# Altium schematic sheet STM32.SchDoc
size B; SheetNumber: 1; SheetTotal: 1
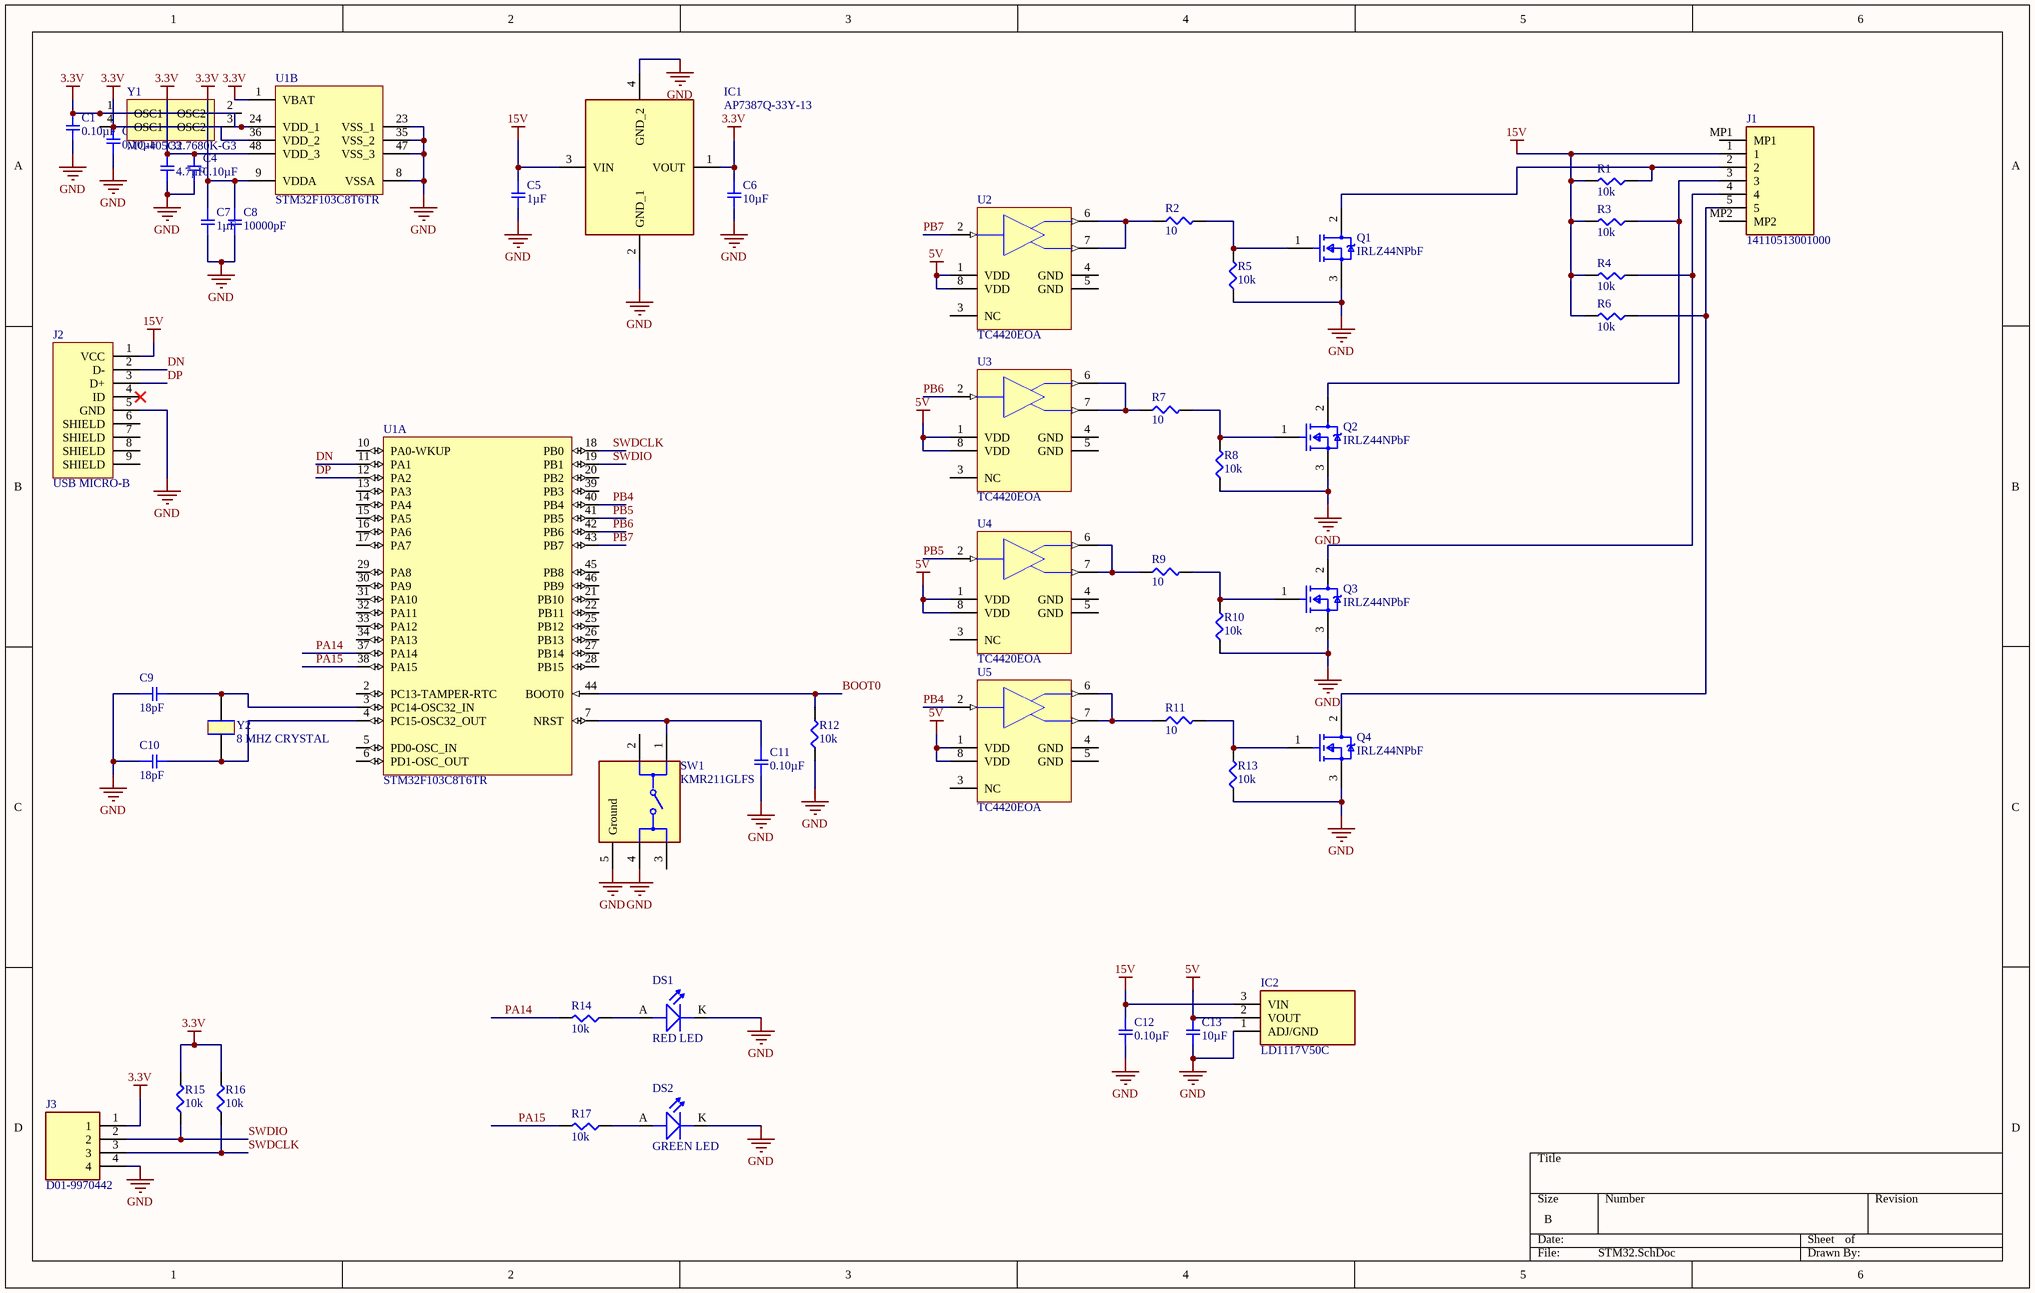
[diagram p0: STM32.SchDoc]

## Parts
C1  0.10µF  [SMD-0402C]
C2  0.10µF  [SMD-0402C]
C3  4.7µF  [SMD-0402C]
C4  0.10µF  [SMD-0402C]
C5  1µF  [SMD-0402C]
C6  10µF  [SMD-0402C]
C7  1µF  [SMD-0402C]
C8  10000pF  [SMD-0402C]
C9  18pF  [SMD-0402C]
C10  18pF  [SMD-0402C]
C11  0.10µF  [SMD-0402C]
C12  0.10µF  [SMD-0402C]
C13  10µF  [SMD-0402C]
DS1  RED LED  [LED_0805]
DS2  GREEN LED  [LED_0805]
IC1  AP7387Q-33Y-13  [AP7387Q50Y13]
IC2  LD1117V50C  [TO255P460X1020X2008-3P]
J1  14110513001000  [14110513001000]
J2  USB MICRO-B  [CON_10118192-0001LF_SMD]
J3  D01-9970442  [RHDR4W53P0X254_1X4_1016X246X254P]
Q1  IRLZ44NPbF  [FP-PG-TO220-3-MFG]
Q2  IRLZ44NPbF  [FP-PG-TO220-3-MFG]
Q3  IRLZ44NPbF  [FP-PG-TO220-3-MFG]
Q4  IRLZ44NPbF  [FP-PG-TO220-3-MFG]
R1  10k  [SMD-0402-RES]
R2  10  [SMD-0402-RES]
R3  10k  [SMD-0402-RES]
R4  10k  [SMD-0402-RES]
R5  10k  [SMD-0402-RES]
R6  10k  [SMD-0402-RES]
R7  10  [SMD-0402-RES]
R8  10k  [SMD-0402-RES]
R9  10  [SMD-0402-RES]
R10  10k  [SMD-0402-RES]
R11  10  [SMD-0402-RES]
R12  10k  [SMD-0402-RES]
R13  10k  [SMD-0402-RES]
R14  10k  [SMD-0402-RES]
R15  10k  [SMD-0402-RES]
R16  10k  [SMD-0402-RES]
R17  10k  [SMD-0402-RES]
SW1  KMR211GLFS  [FP-KMR211GLFS-MFG]
U1  STM32F103C8T6TR  [STM-LQFP48_L]  (parts A,B of 2)
U2  TC4420EOA  [SOIC-OA8_M]
U3  TC4420EOA  [SOIC-OA8_M]
U4  TC4420EOA  [SOIC-OA8_M]
U5  TC4420EOA  [SOIC-OA8_M]
Y1  MC-405 32.7680K-G3  [XTAL_125_74X51_SMD]
Y2  8 MHZ CRYSTAL  [XTAL_193_184X455_TH]

## Nets
3.3V: C1.1 C2.1 C3.1 C4.1 C6.1 C7.1 C8.1 IC1.1(VOUT) J3.1 R15.2 R16.2 U1.1(VBAT) U1.9(VDDA) U1.24(VDD_1) U1.36(VDD_2) U1.48(VDD_3) Y1.1(OSC1) Y1.3(OSC2)
5V: C13.1 IC2.2(VOUT) U2.1(VDD) U2.8(VDD) U3.1(VDD) U3.8(VDD) U4.1(VDD) U4.8(VDD) U5.1(VDD) U5.8(VDD)
15V: C5.1 C12.1 IC1.3(VIN) IC2.3(VIN) J1.1 J2.1(VCC) R1.2 R3.2 R4.2 R6.2
GND: C1.2 C2.2 C3.2 C4.2 C5.2 C6.2 C7.2 C8.2 C9.1 C10.1 C11.2 C12.2 C13.2 DS1.K(CATHODE) DS2.K(CATHODE) IC1.2(GND_1) IC1.4(GND_2) IC2.1(ADJ/GND) J2.5(GND) J3.4 Q1.3(S) Q2.3(S) Q3.3(S) Q4.3(S) R5.1 R8.1 R10.1 R12.1 R13.1 SW1.4 SW1.5(Ground) U1.8(VSSA) U1.23(VSS_1) U1.35(VSS_2) U1.47(VSS_3)
BOOT0: R12.2 U1.44(BOOT0)
DN: J2.2(D-) U1.11(PA1)
DP: J2.3(D+) U1.12(PA2)
PA14: R14.2 U1.37(PA14)
PA15: R17.2 U1.38(PA15)
PB4: U1.40(PB4) U5.2(IN)
PB5: U1.41(PB5) U4.2(IN)
PB6: U1.42(PB6) U3.2(IN)
PB7: U1.43(PB7) U2.2(IN)
SWDCLK: J3.3 R16.1 U1.18(PB0)
SWDIO: J3.2 R15.1 U1.19(PB1)
NetC9_2: C9.2 U1.3(PC14-OSC32_IN) Y2.2
NetC10_2: C10.2 U1.4(PC15-OSC32_OUT) Y2.1
NetC11_1: C11.1 SW1.1 U1.7(NRST)
NetDS1_A: DS1.A(ANODE) R14.1
NetDS2_A: DS2.A(ANODE) R17.1
NetJ1_2: J1.2 Q1.2(D) R1.1
NetJ1_3: J1.3 Q2.2(D) R3.1
NetJ1_4: J1.4 Q3.2(D) R4.1
NetJ1_5: J1.5 Q4.2(D) R6.1
NetQ1_1: Q1.1(G) R2.2 R5.2
NetQ2_1: Q2.1(G) R7.2 R8.2
NetQ3_1: Q3.1(G) R9.2 R10.2
NetQ4_1: Q4.1(G) R11.2 R13.2
NetR2_1: R2.1 U2.6(OUT) U2.7(OUT)
NetR7_1: R7.1 U3.6(OUT) U3.7(OUT)
NetR9_1: R9.1 U4.6(OUT) U4.7(OUT)
NetR11_1: R11.1 U5.6(OUT) U5.7(OUT)

Not connected (* = marked no-connect by the designer): J1 MP1 MP2; J2 4(ID)* 6(SHIELD) 7(SHIELD) 8(SHIELD) 9(SHIELD); SW1 2 3; U1 2(PC13-TAMPER-RTC) 5(PD0-OSC_IN) 6(PD1-OSC_OUT) 10(PA0-WKUP) 13(PA3) 14(PA4) 15(PA5) 16(PA6) 17(PA7) 20(PB2) 21(PB10) 22(PB11) 25(PB12) 26(PB13) 27(PB14) 28(PB15) 29(PA8) 30(PA9) 31(PA10) 32(PA11) 33(PA12) 34(PA13) 39(PB3) 45(PB8) 46(PB9); U2 3(NC) 4(GND) 5(GND); U3 3(NC) 4(GND) 5(GND); U4 3(NC) 4(GND) 5(GND); U5 3(NC) 4(GND) 5(GND); Y1 2(OSC2) 4(OSC1)

## Library data of the parts
C1 C2 C4 = GRM152C80J104KE19D: CAP CER 0.1UF 6.3V X6S 0402; Manufacturer: Murata Electronics North America; Factory Stock: 0; Unit Price (USD): 0.15; Minimum Quantity: 1; Tolerance: ±10%; Datasheets: http://www.murata.com/~/media/webrenewal/support/library/catalog/products/capacitor/mlcc/c02e.pdf; Image: //media.digikey.com/Renders/Murata%20Renders/ZRB-SERIES-0402.jpg; Digi-Key Part Number: 490-9997-1-ND; Part Number: GRM152C80J104KE19D; Quantity Available: 10685; @ qty: 0; Packaging: Cut Tape (CT); Series: GRM; Part Status: Active; Value: 0.10µF; Voltage: 6.3V; Temperature Coefficient: X6S; Operating Temperature: -55°C ~ 105°C; Features: Derating Recommended; Ratings: -; Applications: General Purpose; Mounting Type: Surface Mount, MLCC; Package / Case: 0402 (1005 Metric); Size / Dimension: 0.039" L x 0.020" W (1.00mm x 0.50mm); Height - Seated (Max): -; Thickness (Max): 0.009" (0.22mm); Lead Spacing: -; Lead Style: -
C3 = GRM153R60J475ME15D: CAP CER 4.7UF 6.3V X5R 0402; Manufacturer: Murata Electronics North America; Factory Stock: 0; Unit Price (USD): 0.27; Minimum Quantity: 1; Tolerance: ±20%; Datasheets: http://psearch.en.murata.com/capacitor/product/GRM153R60J475ME15%23.pdf; Image: //media.digikey.com/Renders/Murata%20Renders/ZRB-SERIES-0402.jpg; Digi-Key Part Number: 490-13232-1-ND; Part Number: GRM153R60J475ME15D; Quantity Available: 30412; @ qty: 0; Packaging: Cut Tape (CT); Series: GRM; Part Status: Active; Value: 4.7µF; Voltage: 6.3V; Temperature Coefficient: X5R; Operating Temperature: -55°C ~ 85°C; Features: Derating Recommended; Ratings: -; Applications: General Purpose; Mounting Type: Surface Mount, MLCC; Package / Case: 0402 (1005 Metric); Size / Dimension: 0.039" L x 0.020" W (1.00mm x 0.50mm); Height - Seated (Max): -; Thickness (Max): 0.013" (0.33mm); Lead Spacing: -; Lead Style: -
C5 = GRT155R61E105KE01D: CAP CER 1UF 25V X5R 0402; Manufacturer: Murata Electronics North America; Factory Stock: 0; Unit Price (USD): 0.12; Minimum Quantity: 1; Tolerance: ±10%; Datasheets: http://search.murata.co.jp/Ceramy/image/img/A01X/G101/ENG/GRT155R61E105KE01-01.pdf; Image: //media.digikey.com/Renders/Murata%20Renders/ZRB-SERIES-0402.jpg; Digi-Key Part Number: 490-12263-1-ND; Part Number: GRT155R61E105KE01D; Quantity Available: 12190; @ qty: 0; Packaging: Cut Tape (CT); Series: GRT; Part Status: Active; Value: 1µF; Voltage: 25V; Temperature Coefficient: X5R; Operating Temperature: -55°C ~ 85°C; Features: Derating Recommended; Ratings: AEC-Q200; Applications: Automotive; Mounting Type: Surface Mount, MLCC; Package / Case: 0402 (1005 Metric); Size / Dimension: 0.039" L x 0.020" W (1.00mm x 0.50mm); Height - Seated (Max): -; Thickness (Max): 0.022" (0.55mm); Lead Spacing: -; Lead Style: -
C6 C13 = GRM155C80J106ME11D: CAP CER 10UF 6.3V X6S 0402; Manufacturer: Murata Electronics North America; Factory Stock: 0; Unit Price (USD): 0.18; Minimum Quantity: 1; Tolerance: ±20%; Datasheets: http://psearch.en.murata.com/capacitor/product/GRM155C80J106ME11%23.pdf; Image: //media.digikey.com/Renders/Murata%20Renders/ZRB-SERIES-0402.jpg; Digi-Key Part Number: 490-13233-1-ND; Part Number: GRM155C80J106ME11D; Quantity Available: 60962; @ qty: 0; Packaging: Cut Tape (CT); Series: GRM; Part Status: Active; Value: 10µF; Voltage: 6.3V; Temperature Coefficient: X6S; Operating Temperature: -55°C ~ 105°C; Features: Derating Recommended; Ratings: -; Applications: General Purpose; Mounting Type: Surface Mount, MLCC; Package / Case: 0402 (1005 Metric); Size / Dimension: 0.039" L x 0.020" W (1.00mm x 0.50mm); Height - Seated (Max): -; Thickness (Max): 0.028" (0.70mm); Lead Spacing: -; Lead Style: -
C7 = GCM155C71A105KE38D: CAP CER 1UF 10V X7S 0402; Manufacturer: Murata Electronics North America; Factory Stock: 0; Unit Price (USD): 0.12; Minimum Quantity: 1; Tolerance: ±10%; Datasheets: http://www.murata.com/~/media/webrenewal/support/library/catalog/products/capacitor/mlcc/c03e.ashx; Image: //media.digikey.com/Renders/Murata%20Renders/ZRB-SERIES-0402.jpg; Digi-Key Part Number: 490-13409-1-ND; Part Number: GCM155C71A105KE38D; Quantity Available: 7240; @ qty: 0; Packaging: Cut Tape (CT); Series: GCM; Part Status: Active; Value: 1µF; Voltage: 10V; Temperature Coefficient: X7S; Operating Temperature: -55°C ~ 125°C; Features: -; Ratings: AEC-Q200; Applications: Automotive; Mounting Type: Surface Mount, MLCC; Package / Case: 0402 (1005 Metric); Size / Dimension: 0.039" L x 0.020" W (1.00mm x 0.50mm); Height - Seated (Max): -; Thickness (Max): 0.022" (0.55mm); Lead Spacing: -; Lead Style: -
C8 = GCM155R71E103KA37D: CAP CER 10000PF 25V X7R 0402; Manufacturer: Murata Electronics North America; Factory Stock: 0; Unit Price (USD): 0.1; Minimum Quantity: 1; Tolerance: ±10%; Datasheets: http://www.murata.com/~/media/webrenewal/support/library/catalog/products/capacitor/mlcc/c03e.ashx; Image: //media.digikey.com/Renders/Murata%20Renders/ZRB-SERIES-0402.jpg; Digi-Key Part Number: 490-6043-1-ND; Part Number: GCM155R71E103KA37D; Quantity Available: 128782; @ qty: 0; Packaging: Cut Tape (CT); Series: GCM; Part Status: Active; Value: 10000pF; Voltage: 25V; Temperature Coefficient: X7R; Operating Temperature: -55°C ~ 125°C; Features: -; Ratings: AEC-Q200; Applications: Automotive; Mounting Type: Surface Mount, MLCC; Package / Case: 0402 (1005 Metric); Size / Dimension: 0.039" L x 0.020" W (1.00mm x 0.50mm); Height - Seated (Max): -; Thickness (Max): 0.022" (0.55mm); Lead Spacing: -; Lead Style: -
C9 C10 = GRM1555C1E180JA01D: CAP CER 18PF 25V NP0 0402; Manufacturer: Murata Electronics North America; Factory Stock: 0; Unit Price (USD): 0.1; Minimum Quantity: 1; Tolerance: ±5%; Temperature Coefficient: C0G, NP0; Datasheets: http://www.murata.com/~/media/webrenewal/support/library/catalog/products/capacitor/mlcc/c02e.pdf; Image: //media.digikey.com/Renders/Murata%20Renders/ZRB-SERIES-0402.jpg; Digi-Key Part Number: 490-6172-1-ND; Part Number: GRM1555C1E180JA01D; Quantity Available: 78161; @ qty: 0; Packaging: Cut Tape (CT); Series: GRM; Part Status: Active; Value: 18pF; Voltage: 25V; Operating Temperature: -55°C ~ 125°C; Features: -; Ratings: -; Applications: General Purpose; Mounting Type: Surface Mount, MLCC; Package / Case: 0402 (1005 Metric); Size / Dimension: 0.039" L x 0.020" W (1.00mm x 0.50mm); Height - Seated (Max): -; Thickness (Max): 0.022" (0.55mm); Lead Spacing: -; Lead Style: -
C11 = GRM152C80J104ME19D: CAP CER 0.1UF 6.3V X6S 0402; Manufacturer: Murata Electronics North America; Factory Stock: 0; Unit Price (USD): 0.15; Minimum Quantity: 1; Tolerance: ±20%; Datasheets: http://www.murata.com/~/media/webrenewal/support/library/catalog/products/capacitor/mlcc/c02e.pdf; Image: //media.digikey.com/Renders/Murata%20Renders/ZRB-SERIES-0402.jpg; Digi-Key Part Number: 490-9998-1-ND; Part Number: GRM152C80J104ME19D; Quantity Available: 19095; @ qty: 0; Packaging: Cut Tape (CT); Series: GRM; Part Status: Active; Value: 0.10µF; Voltage: 6.3V; Temperature Coefficient: X6S; Operating Temperature: -55°C ~ 105°C; Features: Derating Recommended; Ratings: -; Applications: General Purpose; Mounting Type: Surface Mount, MLCC; Package / Case: 0402 (1005 Metric); Size / Dimension: 0.039" L x 0.020" W (1.00mm x 0.50mm); Height - Seated (Max): -; Thickness (Max): 0.009" (0.22mm); Lead Spacing: -; Lead Style: -
C12 = GCM155R71C104KA55D: CAP CER 0.1UF 16V X7R 0402; Manufacturer: Murata Electronics North America; Factory Stock: 0; Unit Price (USD): 0.1; Minimum Quantity: 1; Tolerance: ±10%; Datasheets: http://www.murata.com/~/media/webrenewal/support/library/catalog/products/capacitor/mlcc/c03e.ashx; Image: //media.digikey.com/Renders/Murata%20Renders/ZRB-SERIES-0402.jpg; Digi-Key Part Number: 490-4759-1-ND; Part Number: GCM155R71C104KA55D; Quantity Available: 734194; @ qty: 0; Packaging: Cut Tape (CT); Series: GCM; Part Status: Active; Value: 0.10µF; Voltage: 16V; Temperature Coefficient: X7R; Operating Temperature: -55°C ~ 125°C; Features: -; Ratings: AEC-Q200; Applications: Automotive; Mounting Type: Surface Mount, MLCC; Package / Case: 0402 (1005 Metric); Size / Dimension: 0.039" L x 0.020" W (1.00mm x 0.50mm); Height - Seated (Max): -; Thickness (Max): 0.022" (0.55mm); Lead Spacing: -; Lead Style: -
DS1 = LED_RED-2V-20mA-0805: Red 631nm LED Indication - Discrete 2V 0805 (2012 Metric); Manufacturer: Vishay Lite-On; Manufacturer Part Number: LTST-C171KRKT; Alternate Part Number-1: NA; Case/Package: 0805; Supplier-1: SP ROAD; Supplier Part Number-1: LTST-C171KRKT
DS2 = LED_GREEN-2.2-20mA-0805: Green 569nm LED Indication - Discrete 2.1V 0805 (2012 Metric); Manufacturer: Vishay Lite-On; Manufacturer Part Number: LTST-C171GKT; Alternate Part Number-1: NA; Case/Package: 0805; Supplier-1: SP ROAD; Supplier Part Number-1: LTST-C171GKT
IC1 = AP7387Q-33Y-13: Integrated Circuit; Manufacturer_Name: Diodes Inc.; Datasheet Link: https://www.diodes.com/assets/Datasheets/AP7387Q.pdf; Height: 1.6mm; Manufacturer_Part_Number: AP7387Q-33Y-13; Mouser Part Number: 621-AP7387Q-33Y-13; Mouser Price/Stock: https://www.mouser.co.uk/ProductDetail/Diodes-Incorporated/AP7387Q-33Y-13?qs=Y0Uzf4wQF3kvZEnH8zEZig%3D%3D
IC2 = LD1117V50C: Integrated Circuit; Manufacturer_Name: STMicroelectronics; Datasheet Link: https://www.st.com/resource/en/datasheet/ld1117.pdf; Height: 4.6mm; Manufacturer_Part_Number: LD1117V50C; Mouser Part Number: 511-LD1117V50C; Mouser Price/Stock: https://www.mouser.co.uk/ProductDetail/STMicroelectronics/LD1117V50C?qs=1tTY8DFIKADwAqdjtz3zSA%3D%3D; Arrow Part Number: LD1117V50C; Arrow Price/Stock: https://www.arrow.com/en/products/ld1117v50c/stmicroelectronics
J1 = 14110513001000: Connector; Manufacturer_Name: HARTING; Datasheet Link: https://b2b.harting.com/files/download/PRD/PDF_DS/PDF_DS_14111400301.pdf; Height: 7.45mm; Manufacturer_Part_Number: 14110513001000; Mouser Part Number: 617-14110513001000; Mouser Price/Stock: https://www.mouser.co.uk/ProductDetail/HARTING/14110513001000?qs=9nYkJLYMUzvq4GdFieWOAA%3D%3D; Arrow Part Number: 14110513001000; Arrow Price/Stock: https://www.arrow.com/en/products/14110513001000/harting
J2 = CON_USB2.0_MICROB-SMD: USB - micro B USB 2.0 Receptacle Connector 5 Position Surface Mount, Right Angle; Manufacturer: ICC; Manufacturer Part Number: 10118192-0001LF; Alternate Part Number-1: NA; Case/Package: USB MICRO-B SMD; Supplier-1: SUNROM; Supplier Part Number-1: MICRO USB
J3 = D01-9970442: Connector; Manufacturer_Name: Harwin; Datasheet Link: https://cdn.harwin.com/pdfs/D01-997.pdf; Height: 2.54mm; Manufacturer_Part_Number: D01-9970442; Mouser Part Number: 855-D01-9970442; Mouser Price/Stock: https://www.mouser.co.uk/ProductDetail/Harwin/D01-9970442?qs=ecHgFjcWJS%252BUW8IMx%252Bcpow%3D%3D
Q1-Q4 = CMP-32901-000488-1: MOSFET N-CH 55V 47A TO220AB; Turn-On Delay Time: 11ns; Gate to Source Voltage (Vgs): 16V; Element Configuration: Single; Rds On Max: 22mR; Turn-Off Delay Time: 26ns; Max Power Dissipation: 110W; Threshold Voltage: 2V; Drain to Source Resistance: 35mR; Input Capacitance: 1.7nF; Continuous Drain Current (ID): 47A; Case/Package: TO-220; Lead Free: Lead Free; Halogen Free: Halogen Free; Packaging: Rail/Tube; Length: 0.414inch; Min Operating Temperature: -55°C; REACH SVHC: No SVHC; Number of Pins: 3; Width: 0.185inch; Drain to Source Voltage (Vdss): 55V; Power Dissipation: 110W; RoHS Compliant: Yes; Max Operating Temperature: 175°C; Height: 0.6inch; Max Dual Supply Voltage: 55V; Drain to Source Breakdown Voltage: 55V; Mount: Through Hole
R1 R3-R6 R8 R10 R12-R17 = ERJ-2GEJ103X: RES SMD 10K OHM 5% 1/10W 0402; Manufacturer: Panasonic Electronic Components; Factory Stock: 0; Unit Price (USD): 0.00350; @ qty: 1500; Minimum Quantity: 1; Power (Watts): 0.1W, 1/10W; Temperature Coefficient: ±200ppm/°C; Part Number: ERJ-2GEJ103X; Datasheets: http://industrial.panasonic.com/www-cgi/jvcr13pz.cgi?E+PZ+3+AOA0001+ERJ2GEJ103X+7+WW; Image: //media.digikey.com/Photos/Panasonic%20Photos/ERJ-PA2-Series.jpg; Digi-Key Part Number: P10KJCT-ND; Quantity Available: 2560215; Packaging: Cut Tape (CT); Series: ERJ; Part Status: Active; Value: 10k; Tolerance: ±5%; Composition: Thick Film; Features: Automotive AEC-Q200; Operating Temperature: -55°C ~ 155°C; Package / Case: 0402 (1005 Metric); Supplier Device Package: 0402; Size / Dimension: 0.039" L x 0.020" W (1.00mm x 0.50mm); Height - Seated (Max): 0.016" (0.40mm); Number of Terminations: 2; Failure Rate: -
R2 R7 R9 R11 = ERJ-2RKF10R0X: RES SMD 10 OHM 1% 1/10W 0402; Manufacturer: Panasonic Electronic Components; Factory Stock: 0; Unit Price (USD): 0.00496; @ qty: 1500; Minimum Quantity: 1; Power (Watts): 0.1W, 1/10W; Temperature Coefficient: ±100ppm/°C; Part Number: ERJ-2RKF10R0X; Datasheets: http://industrial.panasonic.com/www-cgi/jvcr13pz.cgi?E+PZ+3+AOA0002+ERJ2RKF10R0X+7+WW; Image: //media.digikey.com/Photos/Panasonic%20Photos/ERJ-PA2-Series.jpg; Digi-Key Part Number: P10.0LCT-ND; Quantity Available: 1668494; Packaging: Cut Tape (CT); Series: ERJ; Part Status: Active; Value: 10; Tolerance: ±1%; Composition: Thick Film; Features: Automotive AEC-Q200; Operating Temperature: -55°C ~ 155°C; Package / Case: 0402 (1005 Metric); Supplier Device Package: 0402; Size / Dimension: 0.039" L x 0.020" W (1.00mm x 0.50mm); Height - Seated (Max): 0.016" (0.40mm); Number of Terminations: 2; Failure Rate: -
SW1 = CMP-10040-000023-1: SWITCH TACTILE SPST-NO 0.05A 32V; Switch Function: Off-Mom; Throw Configuration: SPST; Switch Travel: 0.2mm; Current Rating: 50mA; Illumination Type: Non-Illuminated; Actuator Length: 0.5mm; Power Rating: 1W; Operating Force: 1.2N; Actuator Type: Standard; Mechanical Life: 200000Cycles; REACH SVHC: No SVHC; Voltage Rating (DC): 32V; Length: 2.8mm; Min Operating Temperature: -40°C; Mount: Surface Mount; Max Voltage Rating (DC): 32V; Width: 2.8mm; Depth: 4.6mm; Packaging: Tape and Reel; Lead Free: Lead Free; Contact Material: Silver; Termination: Gull Wing; Package Quantity: 1; Contact Current Rating: 50mA; Orientation: Straight; Max Operating Temperature: 85°C; Radiation Hardening: No; Max Current Rating: 50mA; Contact Plating: Silver
U1 = CMP-0237-00216-3: ARM Cortex-M3 32-bit MCU, 64 KB Flash, 20 KB Internal RAM, 37 I/Os, 48-pin LQFP, -40 to 85 degC, Tape and Reel; A/D Converter: 2x12-bit (10 Channel); Internal RAM Size (kB): 20; Supply Voltage(Vcc) min (V): 2; I/Os (High Current): 37; FLASH Size (Prog) (kB): 64; Operating Frequency(F) (Processor speed) (MHz): 72; Packing: Tape and Reel; PackageReference: LQFP48; ComponentLink2Description: Datasheet; Core: ARM Cortex-M3; ComponentLink3URL: http://www.st.com/st-web-ui/static/active/en/resource/technical/document/datasheet/DM00058181.pdf; ComponentLink1Description: Manufacturer URL; ComponentLink3Description: Package Specification; PartNumber: STM32F103C8T6TR; PackageVersion: Rev. 6, 06/2013; ComponentLink2URL: http://www.st.com/st-web-ui/static/active/en/resource/technical/document/datasheet/CD00161566.pdf; PackageDescription: 48-Pin Low Profile Quad Flat Package, 7 x 7 mm Body, 0.5 mm Pitch; Mounting Technology: Surface Mount; DatasheetVersion: Rev. 16; ComponentLink1URL: http://www.st.com/web/en/home.html
U2-U5 = CMP-0137-00254-1: 6A High-Speed MOSFET Driver, Non-Inverting, Industrial Temperature; PackageReference: SOIC-OA8; DatasheetVersion: revC, Aug-2004; Code_IPC: SOIC127P600-8; PackageVersion: revBB, Aug-2009; PackageDescription: 8-Lead Plastic Small Outline (OA) - Narrow, 3.90mm Body [SOIC]
Y1 = XTAL_32.768K-MC-405 32.7680K-G3: 32.768kHz ±100ppm Crystal 20pF 50 kOhms 4-SOJ, 5.50mm pitch; Manufacturer: EPSON; Alternate Part Number-1: MC-405 32.7680K-AC0: ROHS; Manufacturer Part Number: MC-405 32.7680K-G3; Case/Package: 4-SOJ; Supplier-1: Mouser; Supplier Part Number-1: 732-MC405327680KG3RS
Y2 = XTAL_8MHZ-ABL-8.000MHZ-B2: 8MHz ±20ppm Crystal 18pF 80 Ohms HC-49/US; Manufacturer: Yangxing Tech; Alternate Part Number-1: NA; Manufacturer Part Number: ABL-8.000MHZ-B2; Case/Package: TH; Supplier-1: SP ROAD; Supplier Part Number-1: ABL-8.000MHZ-B2